# Altium schematic sheet Temperature_Sensor.SchDoc
size A; SheetNumber: 2; SheetTotal: 2
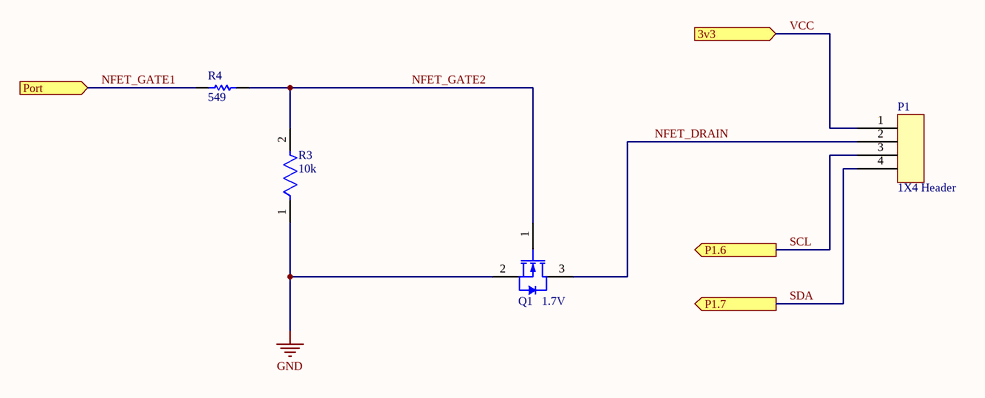
[diagram p0: Temperature_Sensor.SchDoc]

## Parts
P1  1X4 Header  [1X4 HEADER]
Q1_1.7V  (no value)  [FAIR-SOT23-3_V]
R3  10k  [FP-ERJP06-MFG]
R4  549  [RESC2013X70X40LL20T20]

## Ports
3v3 (in), P1.6 (out), P1.7 (out), Port (in)

## Nets
GND: Q1_1.7V.2(S) R3.1
NFET_DRAIN: P1.2 Q1_1.7V.3(D)
NFET_GATE1: R4.1 ; port Port
NFET_GATE2: Q1_1.7V.1(G) R3.2 R4.2
SCL: P1.3 ; port P1.6
SDA: P1.4 ; port P1.7
VCC: P1.1 ; port 3v3

## Library data of the parts
P1 = CMP-004-000002-1: CONN HEADER VERT 4POS 2.54MM; Manufacturer Part Number: 61300411121; Manufacturer: Würth Elektronik; Design Item ID: 1X4 Header; Pin Count: 4; Source: URC.SchLib; Value: 1x4 Header; Component Type: Standard
Q1_1.7V = CMP-013-00021-4: N-Channel Logic Level Enhancement Mode Field Effect Transistor, 220 mA, 50 V, -55 to 150 degC, 3-Pin SOT-23, RoHS, Tape and Reel; Manufacturer: Fairchild; Elements: 1; Nominal Vgs: 1.3V; Resistance: 0.7Ohm; Typical Rise Time: 9ns; Rds On Max: 3.5Ohm; Nominal Dual Supply Voltage: 50V; Input Capacitance: 27pF; Package Version: Rev. 12, 03/2016; Power: 360mW; Packaging: TapeandReel; Package Description: 3-Pin Small Outline Transistor, Body 2.92 x 1.325 mm, Pitch 0.95 mm; Datasheet URL: https://www.fairchildsemi.com/datasheets/BS/BSS138.pdf; Min Operating Temperature: -55°C; Pins: 3; RoHS Compliant: True; Package Reference: SOT23-3; Package Quantity: 1; Case/Package: TO-236-3; Mounting Technology: SM; Max Operating Temperature: 150°C; Datasheet Version: Rev. C, 10/2005
R3 = CMP-05422-000126-1: RES SMD 10K OHM 1% 1/2W 0805; Temperature Coefficient: 100ppm/°C; Resistance: 10kR; Voltage Rating (DC): 150V; Max Power Dissipation: 500mW; Termination: SMD/SMT; Tolerance: 1%; Width: 1.2mm; Case/Package: 0805; Number of Terminations: 2; Resistor Type: Thick Film; Radiation Hardening: No; Resistance Tolerance: 1%; Package Quantity: 5000; Max Operating Temperature: 155°C; RoHS Compliant: Yes; Mount: Surface Mount; Case Code (Imperial): 0805; Construction: Rectangular; Height: 0.6mm; Lead Free: Lead Free; Depth: 1.25mm; Packaging: Tape and Reel; REACH SVHC: No SVHC; Technology: THICK FILM; Features: Automotive AEC-Q200; Contact Plating: Tin; Voltage Rating: 150V; Military Standard: Not; Power Rating: 500mW; Case Code (Metric): 2012; Length: 2mm; Min Operating Temperature: -55°C; Series: ERJ
R4 = CMP-2001-00231-1: Part Number: ERJ-6ENF5490V; Manufacturer: Panasonic